# Altium schematic sheet dtdsl.SchDoc
size A4
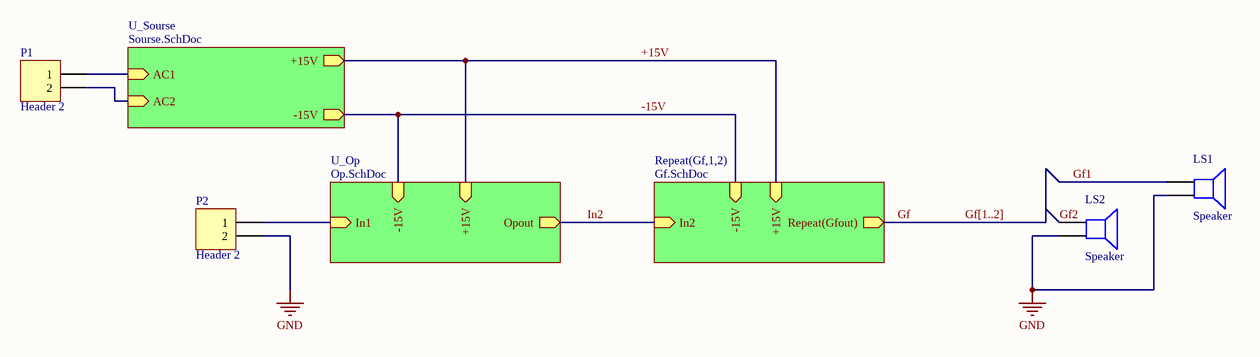
[diagram p0: dtdsl.SchDoc]

## Parts
LS1  Speaker  [PIN2]
LS2  Speaker  [PIN2]
P1  Header 2  [HDR1X2]
P2  Header 2  [HDR1X2]

## Sub-sheets
Repeat(Gf,1,2) = Gf.SchDoc: Repeat(Gfout) (out), +15V (in), -15V (in), In2 (in)
U_Op = Op.SchDoc: In1 (in), +15V (in), -15V (in), Opout (out)
U_Sourse = Sourse.SchDoc: +15V (out), -15V (out), AC1 (in), AC2 (in)

## Nets
GND: LS1.2 LS2.2 P2.2
+15V: sheet Repeat(Gf,1,2)/+15V, sheet U_Op/+15V, sheet U_Sourse/+15V
-15V: sheet Repeat(Gf,1,2)/-15V, sheet U_Op/-15V, sheet U_Sourse/-15V
Gf: sheet Repeat(Gf,1,2)/Repeat(Gfout)
Gf1: LS1.1
Gf2: LS2.1
In2: sheet Repeat(Gf,1,2)/In2, sheet U_Op/Opout
NetP1_1: P1.1 ; sheet U_Sourse/AC1
NetP1_2: P1.2 ; sheet U_Sourse/AC2
NetP2_1: P2.1 ; sheet U_Op/In1

## Buses and harness runs
bus Gf[1..2]

## Library data of the parts
LS1 LS2 = Speaker: Loudspeaker; Published: 24-Mar-1999; LatestRevisionDate: 17-Jul-2002; LatestRevisionNote: Re-released for DXP Platform.; PackageReference: PIN2; Publisher: Altium Limited
P1 P2 = Header 2: Header, 2-Pin; LatestRevisionDate: 17-Jul-2002; LatestRevisionNote: Re-released for DXP Platform.; Publisher: Altium Limited